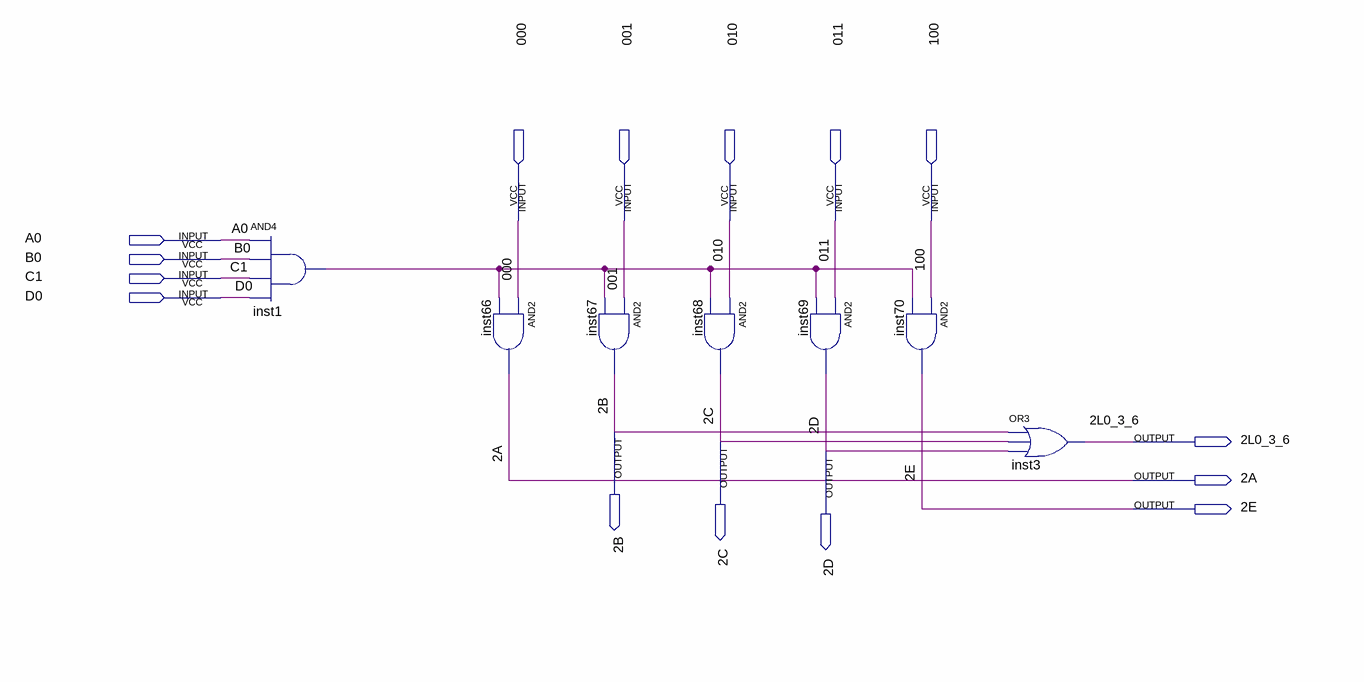
[diagram p0: schematic sheet]
// Quartus schematic carac2.bdf as structural Verilog: 7 symbols, 15 pins
module carac2 (
  input  \000 ,
  input  \001 ,
  input  \010 ,
  input  \011 ,
  input  \100 ,
  input  A0,
  input  B0,
  input  C1,
  input  D0,
  output \2B ,
  output \2C ,
  output \2L0_3_6 ,
  output \2D ,
  output \2A ,
  output \2E 
);

  wire inst1_out;

  and inst1 (inst1_out, A0, B0, C1, D0);
  and inst66 (\2A , \000 , inst1_out);
  and inst67 (\2B , \001 , inst1_out);
  and inst68 (\2C , \010 , inst1_out);
  and inst69 (\2D , \011 , inst1_out);
  and inst70 (\2E , \100 , inst1_out);
  or inst3 (\2L0_3_6 , \2B , \2C , \2D );
endmodule
